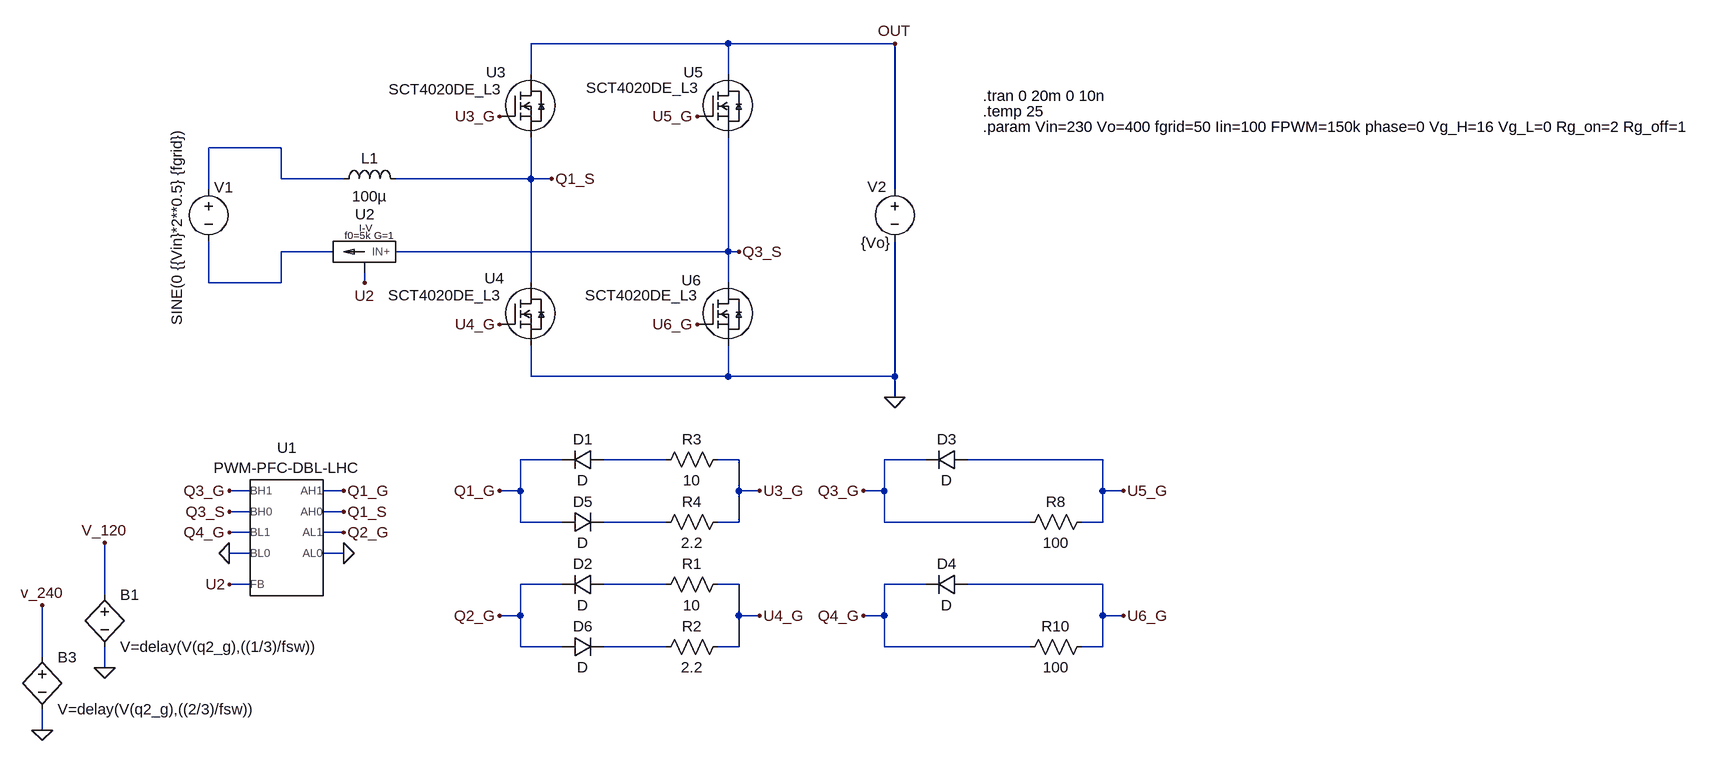
[diagram p0: schematic AC-DC Totem-Pole Bridgeless PFC Vin=200V Iin=100A Synchronous FETs.asc]
AC-DC Totem-Pole Bridgeless PFC Vin=200V Iin=100A Synchronous FETs.asc, the LTspice schematic file:
Version 4.1
SHEET 1 2100 1620
WIRE 496 -32 192 -32
WIRE 752 -32 496 -32
WIRE 192 16 192 -32
WIRE 496 16 496 -32
WIRE -192 128 -304 128
WIRE -192 176 -192 128
WIRE -96 176 -192 176
WIRE 192 176 192 112
WIRE 192 176 -16 176
WIRE 224 176 192 176
WIRE -304 192 -304 128
WIRE 752 192 752 -32
WIRE -112 288 -192 288
WIRE 496 288 496 112
WIRE 496 288 -16 288
WIRE 512 288 496 288
WIRE -304 336 -304 272
WIRE -192 336 -192 288
WIRE -192 336 -304 336
WIRE -64 336 -64 320
WIRE 192 336 192 176
WIRE 496 336 496 288
WIRE 192 480 192 432
WIRE 496 480 496 432
WIRE 496 480 192 480
WIRE 752 480 752 272
WIRE 752 480 496 480
WIRE 752 512 752 480
WIRE 240 608 176 608
WIRE 400 608 304 608
WIRE 512 608 480 608
WIRE 800 608 736 608
WIRE 1072 608 864 608
WIRE -240 656 -272 656
WIRE -96 656 -128 656
WIRE 176 656 176 608
WIRE 176 656 144 656
WIRE 512 656 512 608
WIRE 544 656 512 656
WIRE 736 656 736 608
WIRE 736 656 704 656
WIRE 1072 656 1072 608
WIRE 1104 656 1072 656
WIRE -240 688 -272 688
WIRE -96 688 -128 688
WIRE 176 704 176 656
WIRE 240 704 176 704
WIRE 400 704 304 704
WIRE 512 704 512 656
WIRE 512 704 480 704
WIRE 736 704 736 656
WIRE 960 704 736 704
WIRE 1072 704 1072 656
WIRE 1072 704 1040 704
WIRE -240 720 -272 720
WIRE -96 720 -128 720
WIRE -240 752 -272 752
WIRE -96 752 -128 752
WIRE -240 800 -272 800
WIRE 240 800 176 800
WIRE 400 800 304 800
WIRE 512 800 480 800
WIRE 800 800 736 800
WIRE 1072 800 864 800
WIRE -464 816 -464 736
WIRE 176 848 176 800
WIRE 176 848 144 848
WIRE 512 848 512 800
WIRE 544 848 512 848
WIRE 736 848 736 800
WIRE 736 848 704 848
WIRE 1072 848 1072 800
WIRE 1104 848 1072 848
WIRE 176 896 176 848
WIRE 240 896 176 896
WIRE 400 896 304 896
WIRE 512 896 512 848
WIRE 512 896 480 896
WIRE 736 896 736 848
WIRE 960 896 736 896
WIRE 1072 896 1072 848
WIRE 1072 896 1040 896
WIRE -560 912 -560 832
WIRE -464 928 -464 896
WIRE -560 1024 -560 992
FLAG 752 512 0
FLAG 752 -32 OUT
FLAG 224 176 Q1_S
FLAG 512 288 Q3_S
FLAG -96 656 Q1_G
FLAG -96 688 Q1_S
FLAG -96 720 Q2_G
FLAG -96 752 0
FLAG -272 656 Q3_G
FLAG -272 688 Q3_S
FLAG -272 720 Q4_G
FLAG -272 752 0
FLAG -272 800 U2
FLAG -64 336 U2
FLAG 144 656 Q1_G
FLAG 144 848 Q2_G
FLAG 544 656 U3_G
FLAG 544 848 U4_G
FLAG 704 656 Q3_G
FLAG 704 848 Q4_G
FLAG 1104 656 U5_G
FLAG 1104 848 U6_G
FLAG 144 80 U3_G
FLAG 144 400 U4_G
FLAG 448 80 U5_G
FLAG 448 400 U6_G
FLAG -464 928 0
FLAG -464 736 V_120
FLAG -560 1024 0
FLAG -560 832 v_240
SYMBOL ind -112 192 R270
WINDOW 0 32 56 VTop 2
WINDOW 3 5 56 VBottom 2
SYMATTR InstName L1
SYMATTR Value 100µ
SYMBOL voltage -304 176 M0
WINDOW 123 0 0 Left 2
WINDOW 39 0 0 Left 2
WINDOW 3 49 -79 VRight 2
WINDOW 0 -38 13 Left 2
SYMATTR Value SINE(0 {{Vin}*2**0.5} {fgrid})
SYMATTR InstName V1
SYMBOL voltage 752 176 M0
WINDOW 123 0 0 Left 2
WINDOW 39 0 0 Left 2
WINDOW 0 13 12 Left 2
WINDOW 3 6 98 Left 2
SYMATTR InstName V2
SYMATTR Value {Vo}
SYMBOL I-V -80 288 M0
WINDOW 0 -17 -42 Bottom 2
WINDOW 3 -18 -47 Top 1
WINDOW 39 -61 -25 Left 1
SYMATTR InstName U2
SYMBOL res 496 592 R90
WINDOW 0 0 56 VBottom 2
WINDOW 3 32 56 VTop 2
SYMATTR InstName R3
SYMATTR Value 10
SYMBOL res 496 688 R90
WINDOW 0 0 56 VBottom 2
WINDOW 3 32 56 VTop 2
SYMATTR InstName R4
SYMATTR Value 2.2
SYMBOL res 1056 688 R90
WINDOW 0 0 56 VBottom 2
WINDOW 3 32 56 VTop 2
SYMATTR InstName R8
SYMATTR Value 100
SYMBOL res 1056 880 R90
WINDOW 0 0 56 VBottom 2
WINDOW 3 32 56 VTop 2
SYMATTR InstName R10
SYMATTR Value 100
SYMBOL SCT4020DE_L3 144 16 R0
WINDOW 0 -21 -4 Left 2
WINDOW 3 -171 22 Left 2
SYMATTR InstName U3
SYMBOL SCT4020DE_L3 144 336 R0
WINDOW 0 -23 -7 Left 2
WINDOW 3 -172 19 Left 2
SYMATTR InstName U4
SYMBOL SCT4020DE_L3 448 16 R0
WINDOW 0 -21 -4 Left 2
WINDOW 3 -171 20 Left 2
SYMATTR InstName U5
SYMBOL SCT4020DE_L3 448 336 R0
WINDOW 0 -24 -4 Left 2
WINDOW 3 -173 19 Left 2
SYMATTR InstName U6
SYMBOL PWM-PFC-DBL-LHC -192 784 R0
WINDOW 39 -367 56 Invisible 2
WINDOW 40 -368 90 Invisible 2
SYMATTR SpiceLine fps=fgrid phase=0 td1=200n td2=200n tr1=10n tf1=10n tr2=10n tf2=10n fsw=FPWM
SYMATTR InstName U1
SYMBOL diode 864 592 R90
WINDOW 0 0 32 VBottom 2
WINDOW 3 32 32 VTop 2
SYMATTR InstName D3
SYMBOL diode 864 784 R90
WINDOW 0 0 32 VBottom 2
WINDOW 3 32 32 VTop 2
SYMATTR InstName D4
SYMBOL bv -464 800 R0
SYMATTR InstName B1
SYMATTR Value V=delay(V(q2_g),((1/3)/fsw))
SYMBOL bv -560 896 R0
SYMATTR InstName B3
SYMATTR Value V=delay(V(q2_g),((2/3)/fsw))
SYMBOL diode 304 592 R90
WINDOW 0 0 32 VBottom 2
WINDOW 3 32 32 VTop 2
SYMATTR InstName D1
SYMBOL diode 240 720 R270
WINDOW 0 32 32 VTop 2
WINDOW 3 0 32 VBottom 2
SYMATTR InstName D5
SYMBOL res 496 784 R90
WINDOW 0 0 56 VBottom 2
WINDOW 3 32 56 VTop 2
SYMATTR InstName R1
SYMATTR Value 10
SYMBOL res 496 880 R90
WINDOW 0 0 56 VBottom 2
WINDOW 3 32 56 VTop 2
SYMATTR InstName R2
SYMATTR Value 2.2
SYMBOL diode 304 784 R90
WINDOW 0 0 32 VBottom 2
WINDOW 3 32 32 VTop 2
SYMATTR InstName D2
SYMBOL diode 240 912 R270
WINDOW 0 32 32 VTop 2
WINDOW 3 0 32 VBottom 2
SYMATTR InstName D6
TEXT 888 48 Left 2 !.tran 0 20m 0 10n
TEXT 888 96 Left 2 !.param Vin=230 Vo=400 fgrid=50 Iin=100 FPWM=150k phase=0 Vg_H=16 Vg_L=0 Rg_on=2 Rg_off=1
TEXT 888 72 Left 2 !.temp 25

The netlist it stands for:
* AC-DC Totem-Pole Bridgeless PFC Vin=200V Iin=100A Synchronous FETs.asc
L1 N001 Q1_S 100µ
V1 N001 N002 SINE(0 {{Vin}*2**0.5} {fgrid})
V2 OUT 0 {Vo}
X§U2 Q3_S N002 U2 I-V f0=5k G=1  ; pins IN+ IN- OUT
R3 U3_G N003 10
R4 U3_G N004 2.2
R8 U5_G Q3_G 100
R10 U6_G Q4_G 100
X§U3 OUT U3_G Q1_S SCT4020DE_L3  ; pins D G S
X§U4 Q1_S U4_G 0 SCT4020DE_L3  ; pins D G S
X§U5 OUT U5_G Q3_S SCT4020DE_L3  ; pins D G S
X§U6 Q3_S U6_G 0 SCT4020DE_L3  ; pins D G S
X§U1 Q1_G Q1_S Q2_G 0 Q3_G Q3_S Q4_G 0 U2 PWM-PFC-DBL-LHC fps=fgrid phase=0 td1=200n td2=200n tr1=10n tf1=10n tr2=10n tf2=10n fsw=FPWM Vg_H=18 Vg_L=0 Rso1=0 Rsi1=0 Rso2=0 Rsi2=0 f02=5k GA=5k Vref=0.5  ; pins AH1 AH0 AL1 AL0 BH1 BH0 BL1 BL0 FB
D3 U5_G Q3_G D
D4 U6_G Q4_G D
B1 V_120 0 V=delay(V(q2_g),((1/3)/fsw))
B3 v_240 0 V=delay(V(q2_g),((2/3)/fsw))
D1 N003 Q1_G D
D5 Q1_G N004 D
R1 U4_G N005 10
R2 U4_G N006 2.2
D2 N005 Q2_G D
D6 Q2_G N006 D
.model D D
.lib standard.dio
.tran 0 20m 0 10n
.param Vin=230 Vo=400 fgrid=50 Iin=100 FPWM=150k phase=0 Vg_H=16 Vg_L=0 Rg_on=2 Rg_off=1
.temp 25
.lib SS I-V.lib
.lib SCT4020DE_L3.lib
.lib SS PWM-PFC-DBL-LHC.lib
.backanno
.end